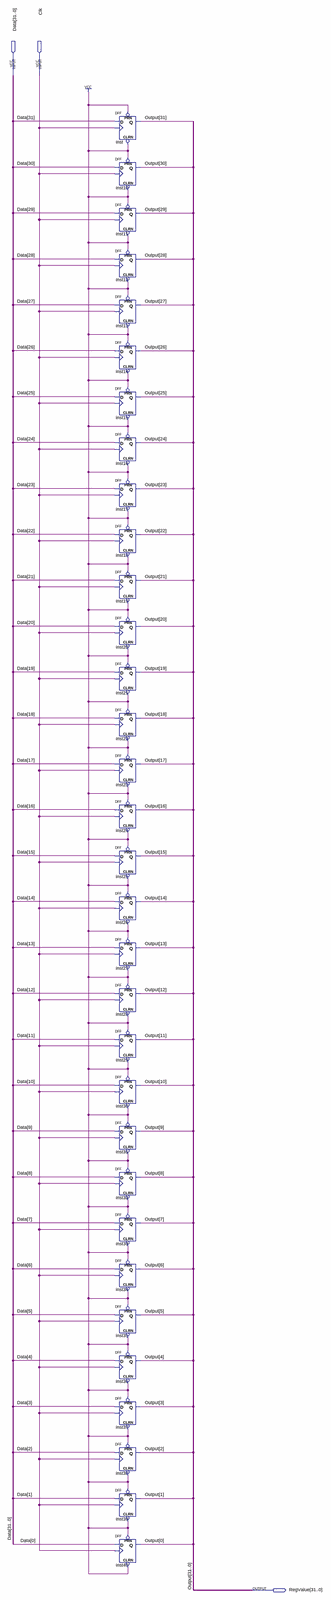
[diagram p0: schematic sheet, whole]
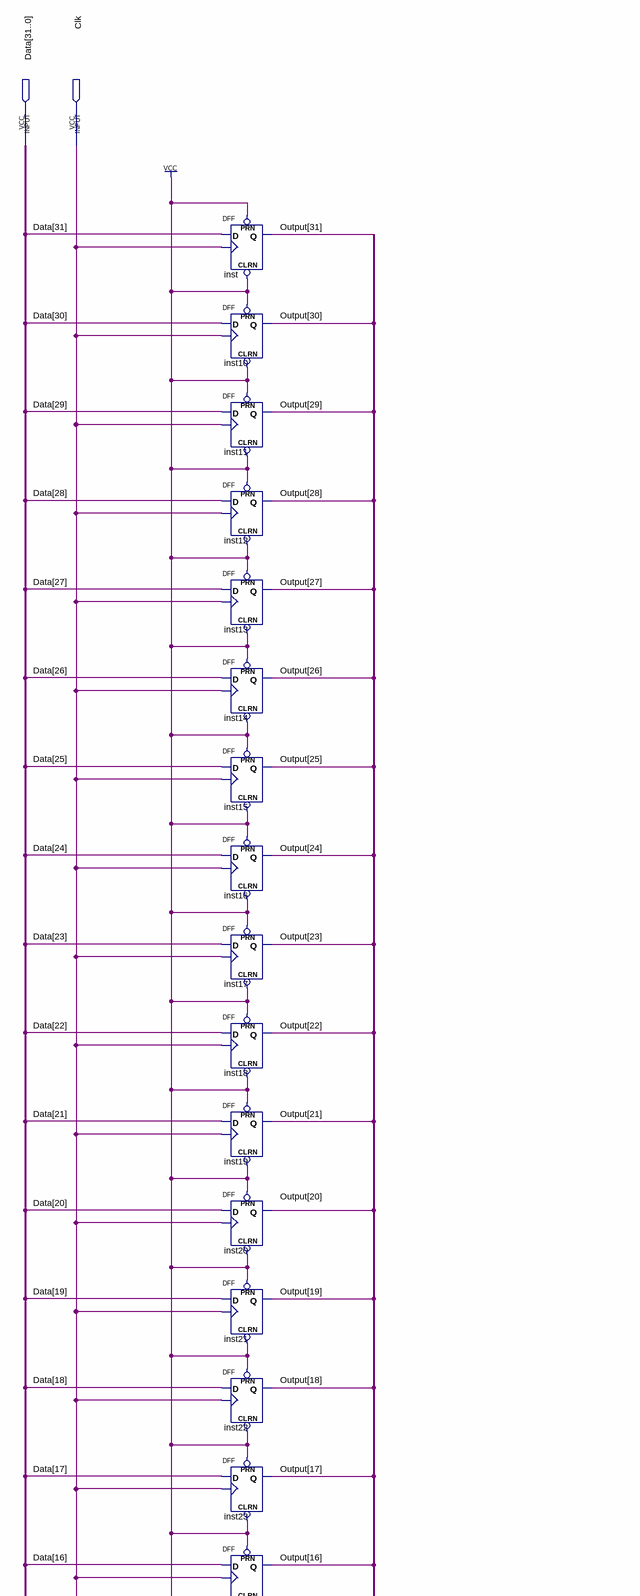
[diagram p1: schematic sheet, upper part]
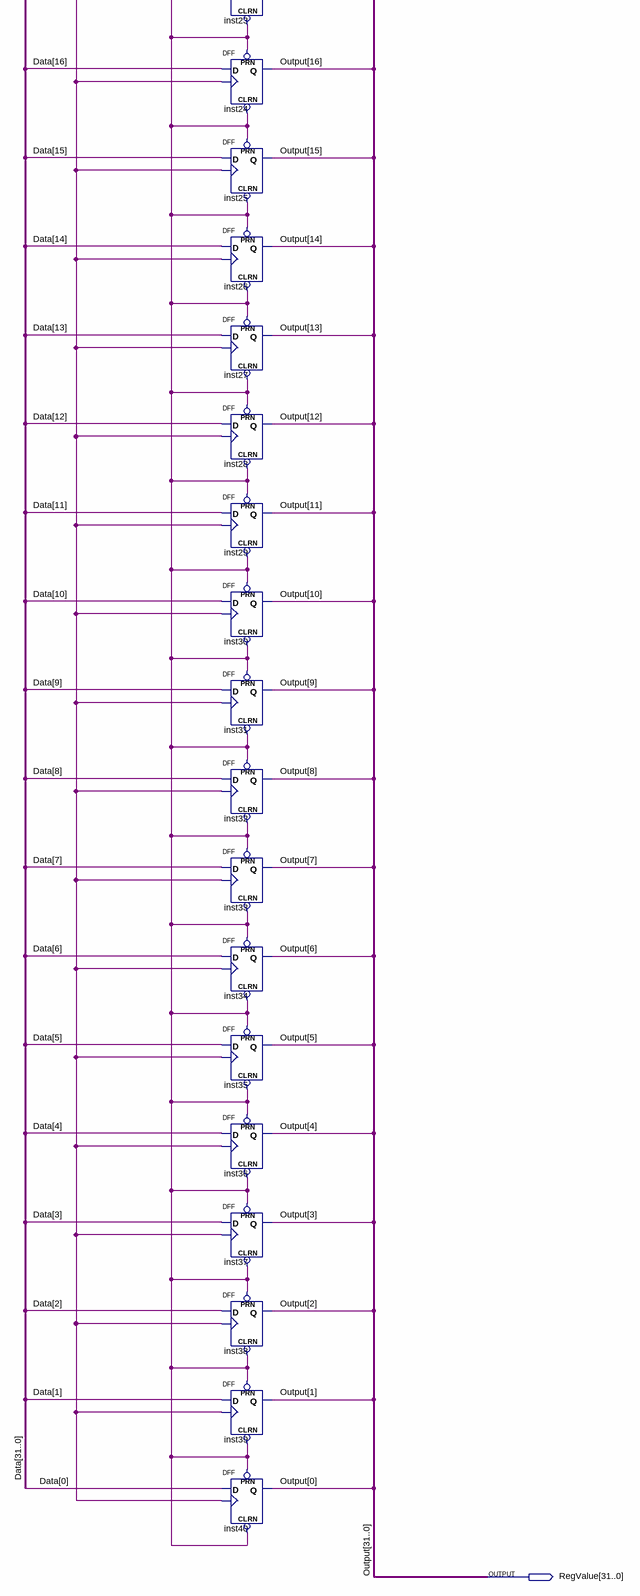
[diagram p2: schematic sheet, lower part]
// Quartus schematic Register.bdf as structural Verilog: 32 symbols, 3 pins
module Register (
  input  [31:0] Data,
  input  Clk,
  output [31:0] RegValue
);

  DFF inst (.CLRN(1'b1), .CLK(Clk), .D(Data[31]), .PRN(1'b1), .Q(RegValue[31]));
  DFF inst10 (.CLRN(1'b1), .CLK(Clk), .D(Data[30]), .PRN(1'b1), .Q(RegValue[30]));
  DFF inst11 (.CLRN(1'b1), .CLK(Clk), .D(Data[29]), .PRN(1'b1), .Q(RegValue[29]));
  DFF inst12 (.CLRN(1'b1), .CLK(Clk), .D(Data[28]), .PRN(1'b1), .Q(RegValue[28]));
  DFF inst13 (.CLRN(1'b1), .CLK(Clk), .D(Data[27]), .PRN(1'b1), .Q(RegValue[27]));
  DFF inst14 (.CLRN(1'b1), .CLK(Clk), .D(Data[26]), .PRN(1'b1), .Q(RegValue[26]));
  DFF inst15 (.CLRN(1'b1), .CLK(Clk), .D(Data[25]), .PRN(1'b1), .Q(RegValue[25]));
  DFF inst16 (.CLRN(1'b1), .CLK(Clk), .D(Data[24]), .PRN(1'b1), .Q(RegValue[24]));
  DFF inst17 (.CLRN(1'b1), .CLK(Clk), .D(Data[23]), .PRN(1'b1), .Q(RegValue[23]));
  DFF inst18 (.CLRN(1'b1), .CLK(Clk), .D(Data[22]), .PRN(1'b1), .Q(RegValue[22]));
  DFF inst19 (.CLRN(1'b1), .CLK(Clk), .D(Data[21]), .PRN(1'b1), .Q(RegValue[21]));
  DFF inst20 (.CLRN(1'b1), .CLK(Clk), .D(Data[20]), .PRN(1'b1), .Q(RegValue[20]));
  DFF inst21 (.CLRN(1'b1), .CLK(Clk), .D(Data[19]), .PRN(1'b1), .Q(RegValue[19]));
  DFF inst22 (.CLRN(1'b1), .CLK(Clk), .D(Data[18]), .PRN(1'b1), .Q(RegValue[18]));
  DFF inst23 (.CLRN(1'b1), .CLK(Clk), .D(Data[17]), .PRN(1'b1), .Q(RegValue[17]));
  DFF inst24 (.CLRN(1'b1), .CLK(Clk), .D(Data[16]), .PRN(1'b1), .Q(RegValue[16]));
  DFF inst25 (.CLRN(1'b1), .CLK(Clk), .D(Data[15]), .PRN(1'b1), .Q(RegValue[15]));
  DFF inst26 (.CLRN(1'b1), .CLK(Clk), .D(Data[14]), .PRN(1'b1), .Q(RegValue[14]));
  DFF inst27 (.CLRN(1'b1), .CLK(Clk), .D(Data[13]), .PRN(1'b1), .Q(RegValue[13]));
  DFF inst28 (.CLRN(1'b1), .CLK(Clk), .D(Data[12]), .PRN(1'b1), .Q(RegValue[12]));
  DFF inst29 (.CLRN(1'b1), .CLK(Clk), .D(Data[11]), .PRN(1'b1), .Q(RegValue[11]));
  DFF inst30 (.CLRN(1'b1), .CLK(Clk), .D(Data[10]), .PRN(1'b1), .Q(RegValue[10]));
  DFF inst31 (.CLRN(1'b1), .CLK(Clk), .D(Data[9]), .PRN(1'b1), .Q(RegValue[9]));
  DFF inst32 (.CLRN(1'b1), .CLK(Clk), .D(Data[8]), .PRN(1'b1), .Q(RegValue[8]));
  DFF inst33 (.CLRN(1'b1), .CLK(Clk), .D(Data[7]), .PRN(1'b1), .Q(RegValue[7]));
  DFF inst34 (.CLRN(1'b1), .CLK(Clk), .D(Data[6]), .PRN(1'b1), .Q(RegValue[6]));
  DFF inst35 (.CLRN(1'b1), .CLK(Clk), .D(Data[5]), .PRN(1'b1), .Q(RegValue[5]));
  DFF inst36 (.CLRN(1'b1), .CLK(Clk), .D(Data[4]), .PRN(1'b1), .Q(RegValue[4]));
  DFF inst37 (.CLRN(1'b1), .CLK(Clk), .D(Data[3]), .PRN(1'b1), .Q(RegValue[3]));
  DFF inst38 (.CLRN(1'b1), .CLK(Clk), .D(Data[2]), .PRN(1'b1), .Q(RegValue[2]));
  DFF inst39 (.CLRN(1'b1), .CLK(Clk), .D(Data[1]), .PRN(1'b1), .Q(RegValue[1]));
  DFF inst40 (.CLRN(1'b1), .CLK(Clk), .D(Data[0]), .PRN(1'b1), .Q(RegValue[0]));

  // Other names for the same wires on the sheet: Output[31:0] = RegValue
endmodule
